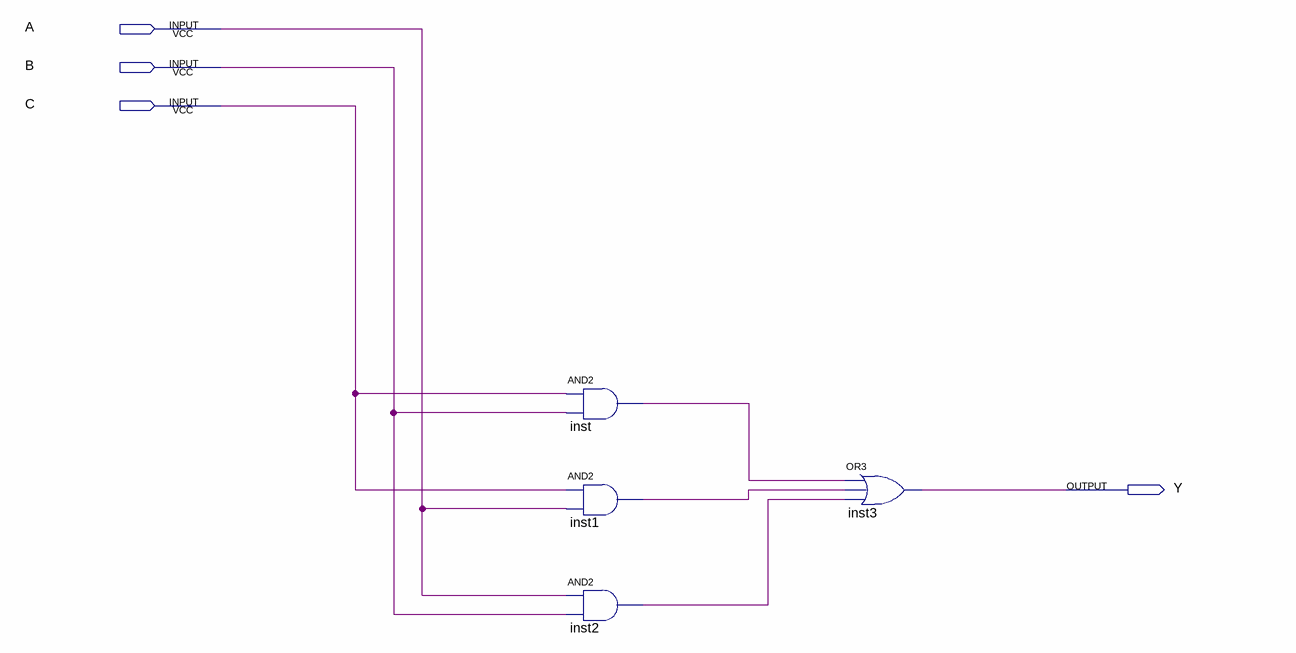
[diagram p0: schematic sheet]
// Quartus schematic Lab4.bdf as structural Verilog: 4 symbols, 4 pins
module Lab4 (
  input  A,
  input  B,
  input  C,
  output Y
);

  wire inst1_out, inst2_out, inst_out;

  and inst (inst_out, C, B);
  and inst1 (inst1_out, C, A);
  and inst2 (inst2_out, A, B);
  or inst3 (Y, inst_out, inst1_out, inst2_out);
endmodule
